# Altium project PCB_Project1.PrjPCB (part 2 of 2)

## Sheet 3-ADC.SchDoc
size A1
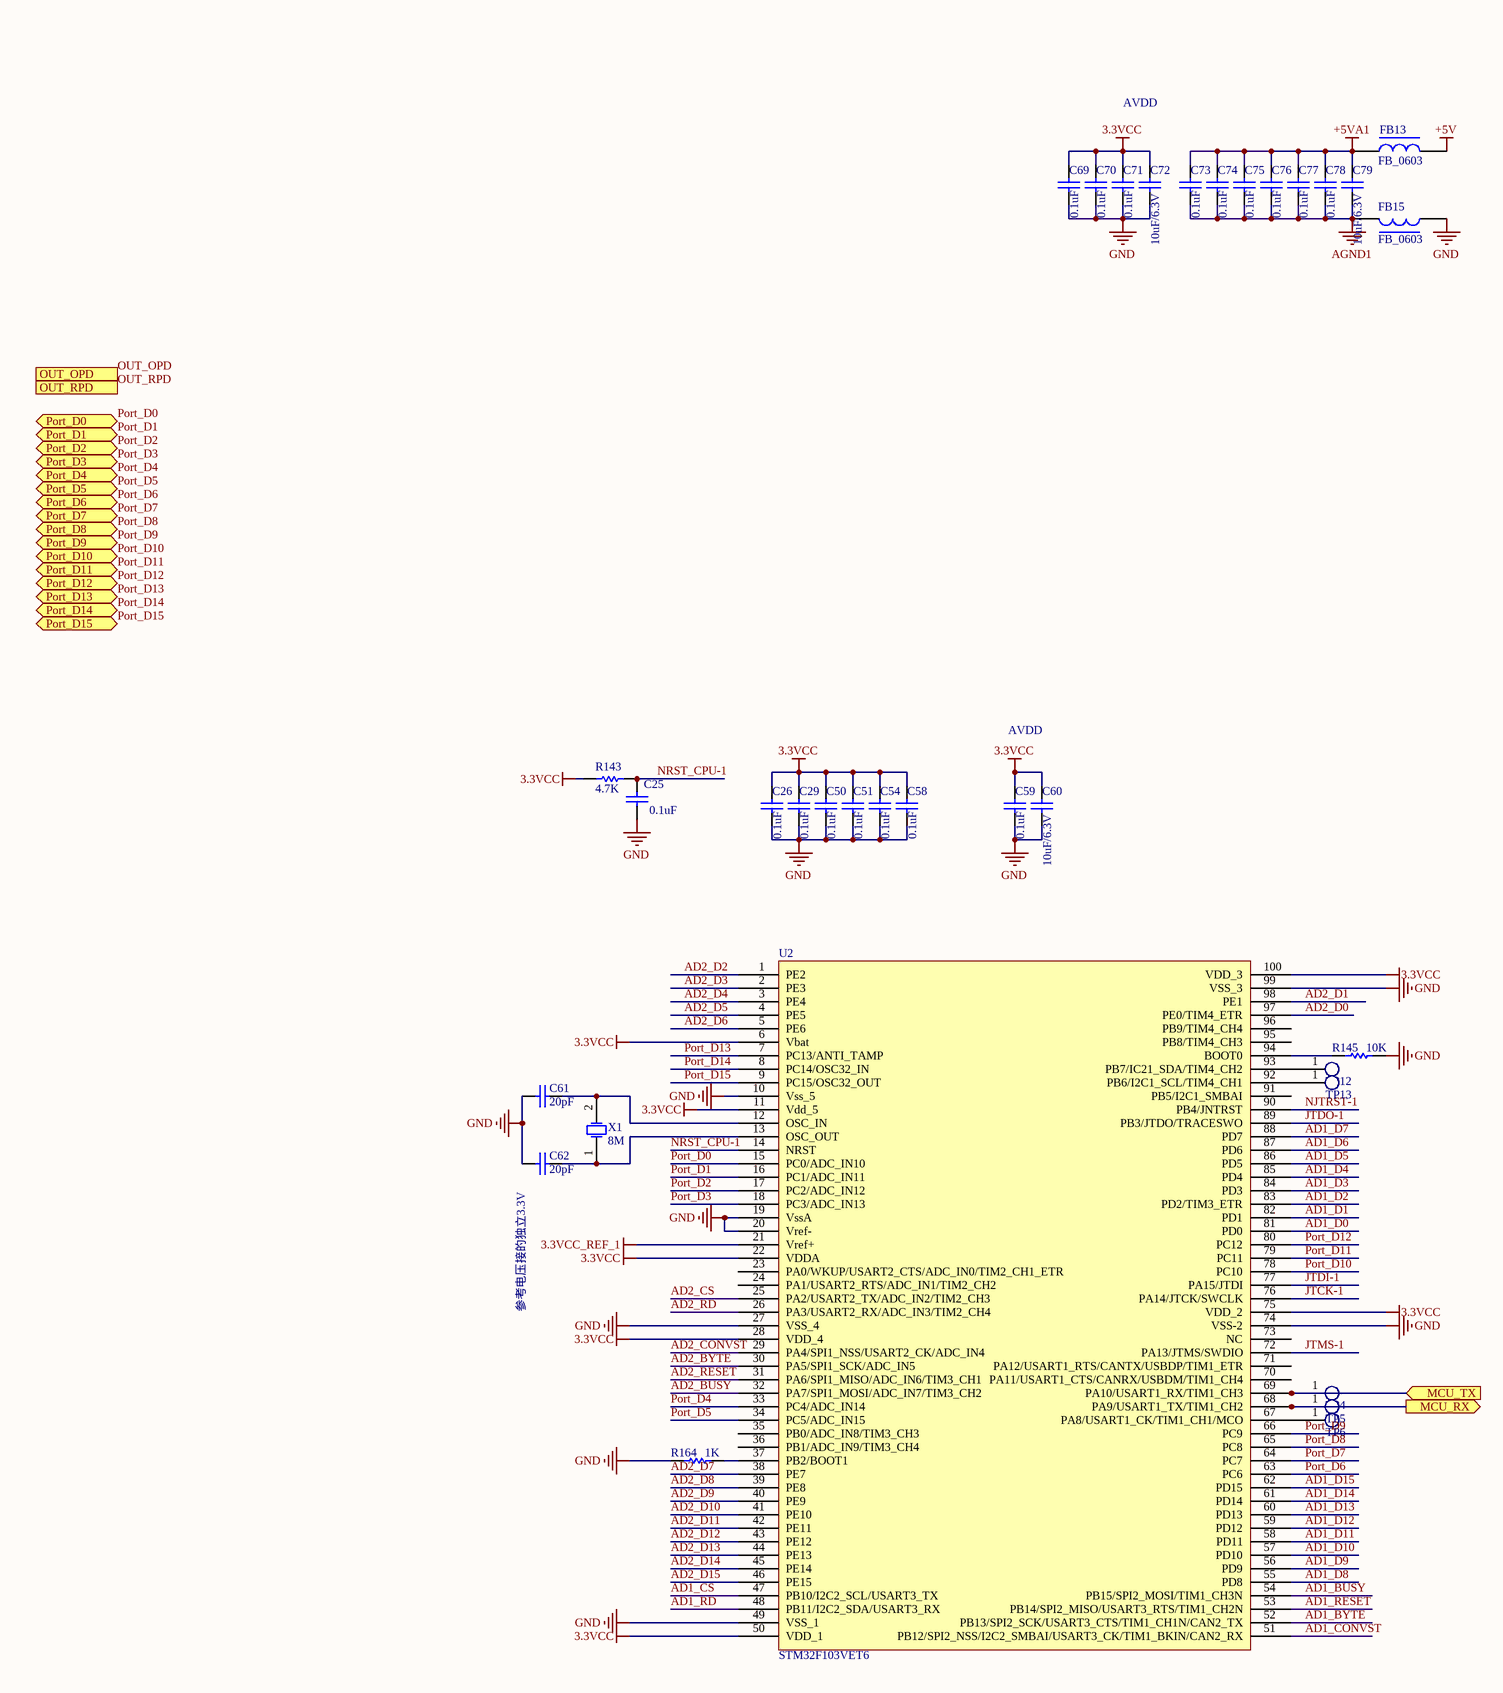
[diagram p7: 3-ADC.SchDoc, top left]
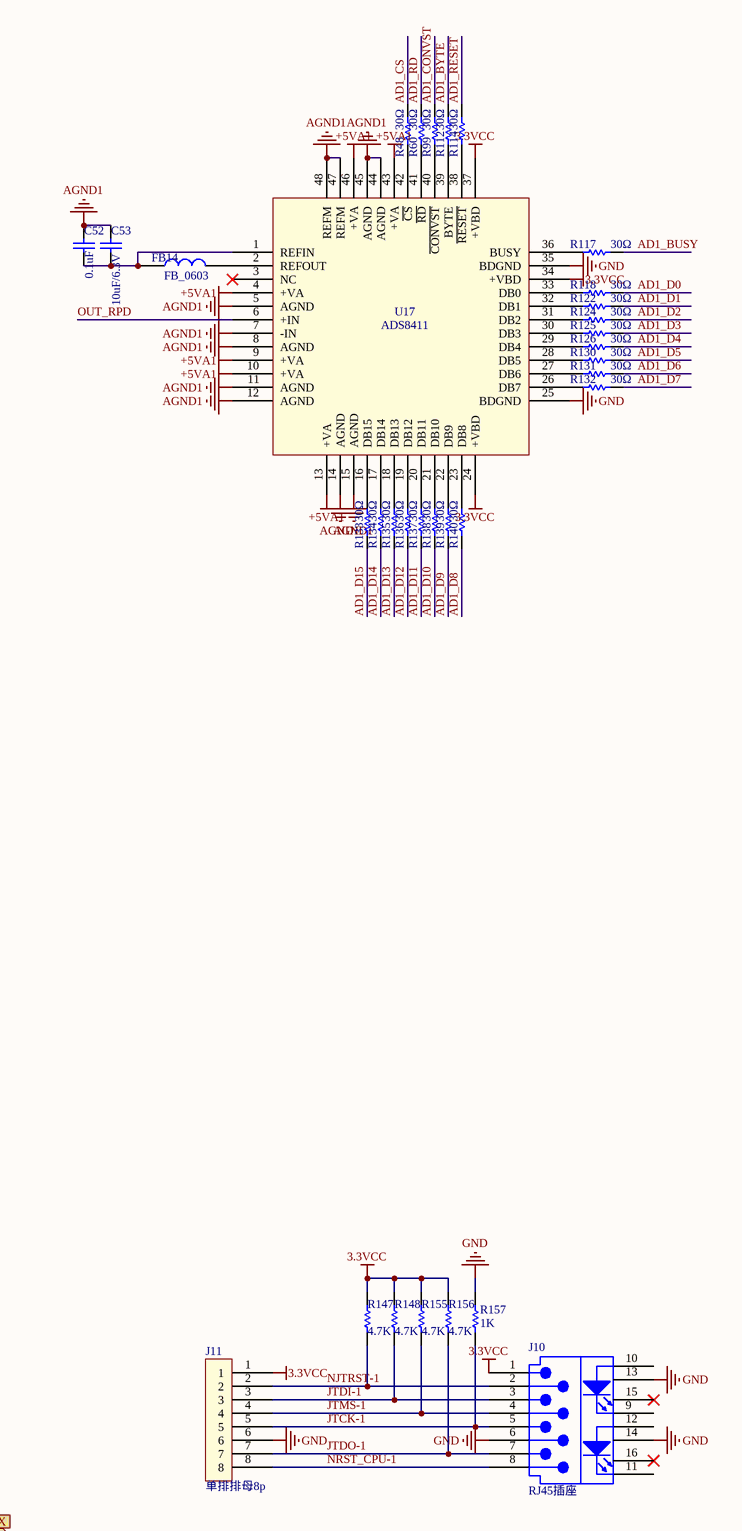
[diagram p8: 3-ADC.SchDoc, top right]
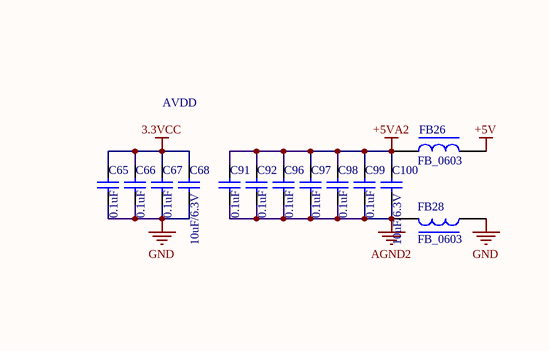
[diagram p9: 3-ADC.SchDoc, bottom left]
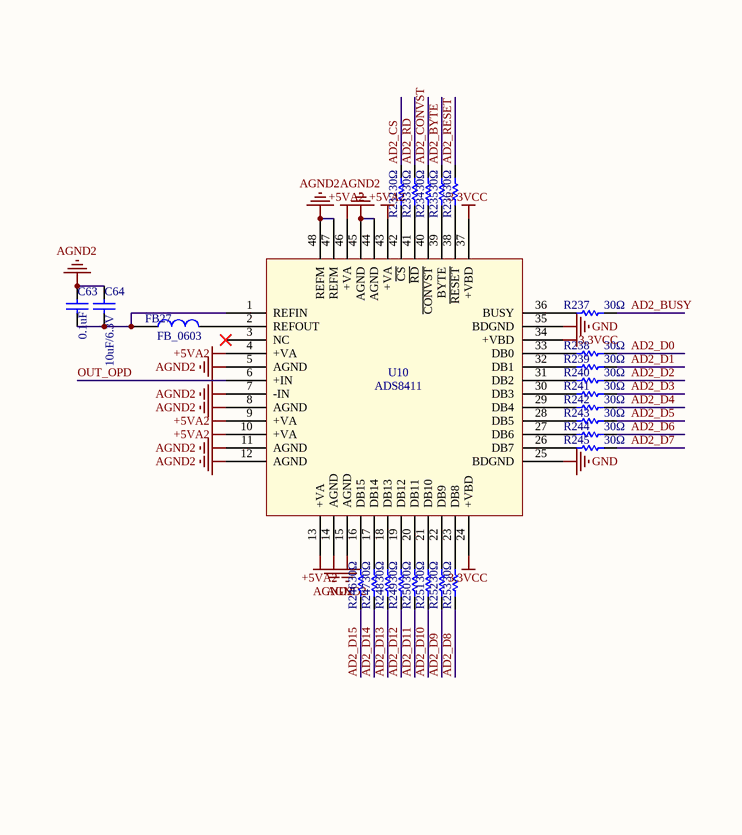
[diagram p10: 3-ADC.SchDoc, bottom right]

### Parts
C25  0.1uF  [C0603]
C26  0.1uF  [C0603]
C29  0.1uF  [C0603]
C50  0.1uF  [C0603]
C51  0.1uF  [C0603]
C52  0.1uF  [C0603]
C53  10uF/6.3V  [C0603]
C54  0.1uF  [C0603]
C58  0.1uF  [C0603]
C59  0.1uF  [C0603]
C60  10uF/6.3V  [C0603]
C61  20pF  [C0603]
C62  20pF  [C0603]
C63  0.1uF  [C0603]
C64  10uF/6.3V  [C0603]
C65  0.1uF  [C0603]
C66  0.1uF  [C0603]
C67  0.1uF  [C0603]
C68  10uF/6.3V  [C0603]
C69  0.1uF  [C0603]
C70  0.1uF  [C0603]
C71  0.1uF  [C0603]
C72  10uF/6.3V  [C0603]
C73  0.1uF  [C0603]
C74  0.1uF  [C0603]
C75  0.1uF  [C0603]
C76  0.1uF  [C0603]
C77  0.1uF  [C0603]
C78  0.1uF  [C0603]
C79  10uF/6.3V  [C0603]
C91  0.1uF  [C0603]
C92  0.1uF  [C0603]
C96  0.1uF  [C0603]
C97  0.1uF  [C0603]
C98  0.1uF  [C0603]
C99  0.1uF  [C0603]
C100  10uF/6.3V  [C0603]
FB13  FB_0603  [L0603]
FB14  FB_0603  [L0603]
FB15  FB_0603  [L0603]
FB26  FB_0603  [L0603]
FB27  FB_0603  [L0603]
FB28  FB_0603  [L0603]
J10  RJ45插座  [RJ45TH-1x1-2R54-LED]
J11  单排排母8p  [SIP8TM-2R54]
R48  30Ω  [R0603]
R60  30Ω  [R0603]
R99  30Ω  [R0603]
R112  30Ω  [R0603]
R114  30Ω  [R0603]
R117  30Ω  [R0603]
R118  30Ω  [R0603]
R122  30Ω  [R0603]
R124  30Ω  [R0603]
R125  30Ω  [R0603]
R126  30Ω  [R0603]
R130  30Ω  [R0603]
R131  30Ω  [R0603]
R132  30Ω  [R0603]
R133  30Ω  [R0603]
R134  30Ω  [R0603]
R135  30Ω  [R0603]
R136  30Ω  [R0603]
R137  30Ω  [R0603]
R138  30Ω  [R0603]
R139  30Ω  [R0603]
R140  30Ω  [R0603]
R143  4.7K  [R0603]
R145  10K  [R0603]
R147  4.7K  [R0603]
R148  4.7K  [R0603]
R155  4.7K  [R0603]
R156  4.7K  [R0603]
R157  1K  [R0603]
R164  1K  [R0603]
R232  30Ω  [R0603]
R233  30Ω  [R0603]
R234  30Ω  [R0603]
R235  30Ω  [R0603]
R236  30Ω  [R0603]
R237  30Ω  [R0603]
R238  30Ω  [R0603]
R239  30Ω  [R0603]
R240  30Ω  [R0603]
R241  30Ω  [R0603]
R242  30Ω  [R0603]
R243  30Ω  [R0603]
R244  30Ω  [R0603]
R245  30Ω  [R0603]
R246  30Ω  [R0603]
R247  30Ω  [R0603]
R248  30Ω  [R0603]
R249  30Ω  [R0603]
R250  30Ω  [R0603]
R251  30Ω  [R0603]
R252  30Ω  [R0603]
R253  30Ω  [R0603]
TP4  TEST  [TP0R8]  (value not drawn)  (no BOM)
TP5  TEST  [TP0R8]  (value not drawn)  (no BOM)
TP6  TEST  [TP0R8]  (value not drawn)  (no BOM)
TP12  TEST  [TP0R8]  (value not drawn)  (no BOM)
TP13  TEST  [TP0R8]  (value not drawn)  (no BOM)
U2  STM32F103VET6  [LQFP100_0R5_14x14]
U10  ADS8411  [TQFN48-0R5-7X7]
U17  ADS8411  [TQFN48-0R5-7X7]
X1  8M  [CRY2SM-6R0x3R5]

### Ports
MCU_RX (out), MCU_TX (in), OUT_OPD (in), OUT_RPD (in), Port_D0 (bidir), Port_D1 (bidir), Port_D2 (bidir), Port_D3 (bidir), Port_D4 (bidir), Port_D5 (bidir), Port_D6 (bidir), Port_D7 (bidir), Port_D8 (bidir), Port_D9 (bidir), Port_D10 (bidir), Port_D11 (bidir), Port_D12 (bidir), Port_D13 (bidir), Port_D14 (bidir), Port_D15 (bidir)

### Nets
3.3VCC: C26.2 C29.2 C50.2 C51.2 C54.2 C58.2 C59.2 C60.2 C65.2 C66.2 C67.2 C68.2 C69.2 C70.2 C71.2 C72.2 J10.1(TX+) J11.1 R143.2 R147.2 R148.2 R155.2 R156.2 U2.6(Vbat) U2.11(Vdd_5) U2.22(VDDA) U2.28(VDD_4) U2.50(VDD_1) U2.75(VDD_2) U2.100(VDD_3) U10.24(+VBD) U10.34(+VBD) U10.37(+VBD) U17.24(+VBD) U17.34(+VBD) U17.37(+VBD)
3.3VCC_REF_1: U2.21(Vref+)
+5V: FB13.2 FB26.2
+5VA1: C73.2 C74.2 C75.2 C76.2 C77.2 C78.2 C79.2 FB13.1 U17.4(+VA) U17.9(+VA) U17.10(+VA) U17.13(+VA) U17.43(+VA) U17.46(+VA)
+5VA2: C91.2 C92.2 C96.2 C97.2 C98.2 C99.2 C100.2 FB26.1 U10.4(+VA) U10.9(+VA) U10.10(+VA) U10.13(+VA) U10.43(+VA) U10.46(+VA)
AGND1: C52.2 C53.2 C73.1 C74.1 C75.1 C76.1 C77.1 C78.1 C79.1 FB15.2 U17.5(AGND) U17.7(-IN) U17.8(AGND) U17.11(AGND) U17.12(AGND) U17.14(AGND) U17.15(AGND) U17.44(AGND) U17.45(AGND) U17.47(REFM) U17.48(REFM)
AGND2: C63.2 C64.2 C91.1 C92.1 C96.1 C97.1 C98.1 C99.1 C100.1 FB28.2 U10.5(AGND) U10.7(-IN) U10.8(AGND) U10.11(AGND) U10.12(AGND) U10.14(AGND) U10.15(AGND) U10.44(AGND) U10.45(AGND) U10.47(REFM) U10.48(REFM)
GND: C25.1 C26.1 C29.1 C50.1 C51.1 C54.1 C58.1 C59.1 C60.1 C61.2 C62.2 C65.1 C66.1 C67.1 C68.1 C69.1 C70.1 C71.1 C72.1 FB15.1 FB28.1 J10.6(RX-) J10.13 J10.14 J11.6 R145.1 R157.1 R164.1 U2.10(Vss_5) U2.19(VssA) U2.20(Vref-) U2.27(VSS_4) U2.49(VSS_1) U2.74(VSS-2) U2.99(VSS_3) U10.25(BDGND) U10.35(BDGND) U17.25(BDGND) U17.35(BDGND)
AD1_BUSY: R117.2 U2.54(PB15/SPI2_MOSI/TIM1_CH3N)
AD1_BYTE: R112.2 U2.52(PB13/SPI2_SCK/USART3_CTS/TIM1_CH1N/CAN2_TX)
AD1_CONVST: R99.2 U2.51(PB12/SPI2_NSS/I2C2_SMBAI/USART3_CK/TIM1_BKIN/CAN2_RX)
AD1_CS: R48.2 U2.47(PB10/I2C2_SCL/USART3_TX)
AD1_D0: R118.2 U2.81(PD0)
AD1_D1: R122.2 U2.82(PD1)
AD1_D2: R124.2 U2.83(PD2/TIM3_ETR)
AD1_D3: R125.2 U2.84(PD3)
AD1_D4: R126.2 U2.85(PD4)
AD1_D5: R130.2 U2.86(PD5)
AD1_D6: R131.2 U2.87(PD6)
AD1_D7: R132.2 U2.88(PD7)
AD1_D8: R140.1 U2.55(PD8)
AD1_D9: R139.1 U2.56(PD9)
AD1_D10: R138.1 U2.57(PD10)
AD1_D11: R137.1 U2.58(PD11)
AD1_D12: R136.1 U2.59(PD12)
AD1_D13: R135.1 U2.60(PD13)
AD1_D14: R134.1 U2.61(PD14)
AD1_D15: R133.1 U2.62(PD15)
AD1_RD: R60.2 U2.48(PB11/I2C2_SDA/USART3_RX)
AD1_RESET: R114.2 U2.53(PB14/SPI2_MISO/USART3_RTS/TIM1_CH2N)
AD2_BUSY: R237.2 U2.32(PA7/SPI1_MOSI/ADC_IN7/TIM3_CH2)
AD2_BYTE: R235.2 U2.30(PA5/SPI1_SCK/ADC_IN5)
AD2_CONVST: R234.2 U2.29(PA4/SPI1_NSS/USART2_CK/ADC_IN4)
AD2_CS: R232.2 U2.25(PA2/USART2_TX/ADC_IN2/TIM2_CH3)
AD2_D0: R238.2 U2.97(PE0/TIM4_ETR)
AD2_D1: R239.2 U2.98(PE1)
AD2_D2: R240.2 U2.1(PE2)
AD2_D3: R241.2 U2.2(PE3)
AD2_D4: R242.2 U2.3(PE4)
AD2_D5: R243.2 U2.4(PE5)
AD2_D6: R244.2 U2.5(PE6)
AD2_D7: R245.2 U2.38(PE7)
AD2_D8: R253.1 U2.39(PE8)
AD2_D9: R252.1 U2.40(PE9)
AD2_D10: R251.1 U2.41(PE10)
AD2_D11: R250.1 U2.42(PE11)
AD2_D12: R249.1 U2.43(PE12)
AD2_D13: R248.1 U2.44(PE13)
AD2_D14: R247.1 U2.45(PE14)
AD2_D15: R246.1 U2.46(PE15)
AD2_RD: R233.2 U2.26(PA3/USART2_RX/ADC_IN3/TIM2_CH4)
AD2_RESET: R236.2 U2.31(PA6/SPI1_MISO/ADC_IN6/TIM3_CH1)
JTCK-1: J10.5(NC) J11.5 R157.2 U2.76(PA14/JTCK/SWCLK)
JTDI-1: J10.3(RX+) J11.3 R148.1 U2.77(PA15/JTDI)
JTDO-1: J10.7(NC) J11.7 R156.1 U2.89(PB3/JTDO/TRACESWO)
JTMS-1: J10.4(NC) J11.4 R155.1 U2.72(PA13/JTMS/SWDIO)
NJTRST-1: J10.2(TX-) J11.2 R147.1 U2.90(PB4/JNTRST)
NRST_CPU-1: C25.2 J10.8(NC) J11.8 R143.1 U2.14(NRST)
OUT_OPD: U10.6(+IN) ; port OUT_OPD
OUT_RPD: U17.6(+IN) ; port OUT_RPD
Port_D0: U2.15(PC0/ADC_IN10) ; port Port_D0
Port_D1: U2.16(PC1/ADC_IN11) ; port Port_D1
Port_D2: U2.17(PC2/ADC_IN12) ; port Port_D2
Port_D3: U2.18(PC3/ADC_IN13) ; port Port_D3
Port_D4: U2.33(PC4/ADC_IN14) ; port Port_D4
Port_D5: U2.34(PC5/ADC_IN15) ; port Port_D5
Port_D6: U2.63(PC6) ; port Port_D6
Port_D7: U2.64(PC7) ; port Port_D7
Port_D8: U2.65(PC8) ; port Port_D8
Port_D9: U2.66(PC9) ; port Port_D9
Port_D10: U2.78(PC10) ; port Port_D10
Port_D11: U2.79(PC11) ; port Port_D11
Port_D12: U2.80(PC12) ; port Port_D12
Port_D13: U2.7(PC13/ANTI_TAMP) ; port Port_D13
Port_D14: U2.8(PC14/OSC32_IN) ; port Port_D14
Port_D15: U2.9(PC15/OSC32_OUT) ; port Port_D15
NetC52_1: C52.1 C53.1 FB14.1 U17.1(REFIN)
NetC61_1: C61.1 U2.12(OSC_IN) X1.2(OSC2)
NetC62_1: C62.1 U2.13(OSC_OUT) X1.1(OSC1)
NetC63_1: C63.1 C64.1 FB27.1 U10.1(REFIN)
NetFB14_2: FB14.2 U17.2(REFOUT)
NetFB27_2: FB27.2 U10.2(REFOUT)
NetR48_1: R48.1 U17.42(~{CS})
NetR60_1: R60.1 U17.41(~{RD})
NetR99_1: R99.1 U17.40(~{CONVST})
NetR112_1: R112.1 U17.39(BYTE)
NetR114_1: R114.1 U17.38(~{RESET})
NetR117_1: R117.1 U17.36(BUSY)
NetR118_1: R118.1 U17.33(DB0)
NetR122_1: R122.1 U17.32(DB1)
NetR124_1: R124.1 U17.31(DB2)
NetR125_1: R125.1 U17.30(DB3)
NetR126_1: R126.1 U17.29(DB4)
NetR130_1: R130.1 U17.28(DB5)
NetR131_1: R131.1 U17.27(DB6)
NetR132_1: R132.1 U17.26(DB7)
NetR133_2: R133.2 U17.16(DB15)
NetR134_2: R134.2 U17.17(DB14)
NetR135_2: R135.2 U17.18(DB13)
NetR136_2: R136.2 U17.19(DB12)
NetR137_2: R137.2 U17.20(DB11)
NetR138_2: R138.2 U17.21(DB10)
NetR139_2: R139.2 U17.22(DB9)
NetR140_2: R140.2 U17.23(DB8)
NetR145_2: R145.2 U2.94(BOOT0)
NetR164_2: R164.2 U2.37(PB2/BOOT1)
NetR177_1: TP5.1(TP) U2.68(PA9/USART1_TX/TIM1_CH2) ; port MCU_RX
NetR178_1: TP4.1(TP) U2.69(PA10/USART1_RX/TIM1_CH3) ; port MCU_TX
NetR232_1: R232.1 U10.42(~{CS})
NetR233_1: R233.1 U10.41(~{RD})
NetR234_1: R234.1 U10.40(~{CONVST})
NetR235_1: R235.1 U10.39(BYTE)
NetR236_1: R236.1 U10.38(~{RESET})
NetR237_1: R237.1 U10.36(BUSY)
NetR238_1: R238.1 U10.33(DB0)
NetR239_1: R239.1 U10.32(DB1)
NetR240_1: R240.1 U10.31(DB2)
NetR241_1: R241.1 U10.30(DB3)
NetR242_1: R242.1 U10.29(DB4)
NetR243_1: R243.1 U10.28(DB5)
NetR244_1: R244.1 U10.27(DB6)
NetR245_1: R245.1 U10.26(DB7)
NetR246_2: R246.2 U10.16(DB15)
NetR247_2: R247.2 U10.17(DB14)
NetR248_2: R248.2 U10.18(DB13)
NetR249_2: R249.2 U10.19(DB12)
NetR250_2: R250.2 U10.20(DB11)
NetR251_2: R251.2 U10.21(DB10)
NetR252_2: R252.2 U10.22(DB9)
NetR253_2: R253.2 U10.23(DB8)
NetTP6_1: TP6.1(TP) U2.67(PA8/USART1_CK/TIM1_CH1/MCO)
NetTP12_1: TP12.1(TP) U2.93(PB7/IC21_SDA/TIM4_CH2)
NetTP13_1: TP13.1(TP) U2.92(PB6/I2C1_SCL/TIM4_CH1)

Not connected (* = marked no-connect by the designer): J10 9(K1) 10(A1) 11(K2) 12(A2) 15* 16*; U2 23(PA0/WKUP/USART2_CTS/ADC_IN0/TIM2_CH1_ETR) 24(PA1/USART2_RTS/ADC_IN1/TIM2_CH2) 35(PB0/ADC_IN8/TIM3_CH3) 36(PB1/ADC_IN9/TIM3_CH4) 70(PA11/USART1_CTS/CANRX/USBDM/TIM1_CH4) 71(PA12/USART1_RTS/CANTX/USBDP/TIM1_ETR) 73(NC) 91(PB5/I2C1_SMBAI) 95(PB8/TIM4_CH3) 96(PB9/TIM4_CH4); U10 3(NC)*; U17 3(NC)*

### Notes on the sheet
- AVDD
- 参考电压接的独立3.3V

### Library data of the parts
C25 C26 C29 C50-C52 C54 C58 C59 C63 C65-C67 C69-C71 C73-C78 C91 C92 C96-C99 = 0.1uF贴片电容: 贴片电容_GRM188R71H104KA01D_0.1uF±10%,50V,0603; code: 01010045
C53 C60 C64 C68 C72 C79 C100 = 10uF贴片电容: 贴片电容_GRM188R60J106ME47D_10uF±20%,6.3V,0603; code: 01010037
C61 C62 = 20pF贴片电容: 贴片电容_GRM188C1H200JB01D_20pF±5%,50V,0603; code: 01010035
FB13-FB15 FB26-FB28 = 0603贴片磁珠: 贴片磁珠_100R,0603; code: 0103016
J10 = RJ45弯脚带灯: RJ45插座_1*1,带左黄右绿灯,弯脚; MPN: 朱迅; code: 01090042
J11 = 8p-2.54单排母座: 连接器_单排排母座8p_直插,间距2.54mm; MPN: WS; code: 01090052
R48 R60 R99 R112 R114 R117 R118 R122 R124-R126 R130-R140 R232-R253 = 30Ω贴片电阻: 贴片电阻_30Ω±5%,0603; code: 01020108
R143 R147 R148 R155 R156 = 4.7K贴片电阻: 贴片电阻_4.7K±5%,0603; code: 01020012
R145 = 10K贴片电阻: 贴片电阻_10K±5%,0603; code: 01020011
R157 R164 = 1K贴片电阻: 贴片电阻_1K±5%,0603; code: 01020082
TP4-TP6 TP12 TP13 = TP0.8mm: 表贴测试点0.8mm
U2 = STM32F103VET: MCU_STM32F103VET6_32 bit, LQFP100; Maker: ST; code: 01060037
U10 U17 = ADS8411: 模数转换芯片_ADS8411_16-Bit,2MSPS,QFN48
X1 = 8M贴片无源晶体: 贴片无源晶体_8MHz,封装6035; code: 03050006

## Nets that join several sheets
3.3VCC: 1-MCU (108 pins), 3-ADC (36 pins)
+5V: 1-MCU (20 pins), 3-ADC (FB13.2 FB26.2)
GND: 1-MCU (256 pins), 2-RJ45 (72 pins), 3-ADC (39 pins)
LINKLED: 1-MCU (R165.1), 2-RJ45 (R78.2 U9.25)
LINKLED2: 1-MCU (R162.2), 2-RJ45 (R280.2 U37.25)
NetR177_1: 1-MCU (R177.1), 3-ADC (TP5.1 U2.68)
NetR178_1: 1-MCU (R178.1), 3-ADC (TP4.1 U2.69)
Port_D0: 1-MCU (R115.2), 3-ADC (U2.15)
Port_D1: 1-MCU (R123.2), 3-ADC (U2.16)
Port_D2: 1-MCU (R142.1), 3-ADC (U2.17)
Port_D3: 1-MCU (R141.1), 3-ADC (U2.18)
Port_D4: 1-MCU (R119.1), 3-ADC (U2.33)
Port_D5: 1-MCU (R113.1), 3-ADC (U2.34)
Port_D6: 1-MCU (R111.1), 3-ADC (U2.63)
Port_D7: 1-MCU (R100.1), 3-ADC (U2.64)
Port_D8: 1-MCU (R98.1), 3-ADC (U2.65)
Port_D9: 1-MCU (R95.1), 3-ADC (U2.66)
Port_D10: 1-MCU (R94.1), 3-ADC (U2.78)
Port_D11: 1-MCU (R59.1), 3-ADC (U2.79)
Port_D12: 1-MCU (R47.1), 3-ADC (U2.80)
Port_D13: 1-MCU (R27.1), 3-ADC (U2.7)
Port_D14: 1-MCU (R26.1), 3-ADC (U2.8)
Port_D15: 1-MCU (R20.1), 3-ADC (U2.9)
SPI1_MISO: 1-MCU (R328.1), 2-RJ45 (U37.34)
SPI1_MOSI: 1-MCU (R329.1), 2-RJ45 (U37.35)
SPI1_NSS: 1-MCU (R327.1), 2-RJ45 (R271.1 U37.32)
SPI1_SCK: 1-MCU (R326.1), 2-RJ45 (U37.33)
SPI2_MISO: 1-MCU (R30.2), 2-RJ45 (U9.34)
SPI2_MOSI: 1-MCU (R29.2), 2-RJ45 (U9.35)
SPI2_NSS: 1-MCU (R35.2), 2-RJ45 (R69.1 U9.32)
SPI2_SCK: 1-MCU (R32.2), 2-RJ45 (U9.33)
W5500_INTn: 1-MCU (U16.60), 2-RJ45 (U9.36)
W5500_INTn1: 1-MCU (U16.70), 2-RJ45 (U37.36)
W5500_RSTn: 1-MCU (U16.59), 2-RJ45 (R67.1 U9.37)
W5500_RSTn1: 1-MCU (U16.69), 2-RJ45 (R269.1 U37.37)